# Altium schematic sheet 51开发设计.SchDoc
size A4; SheetNumber: 1; SheetTotal: 1
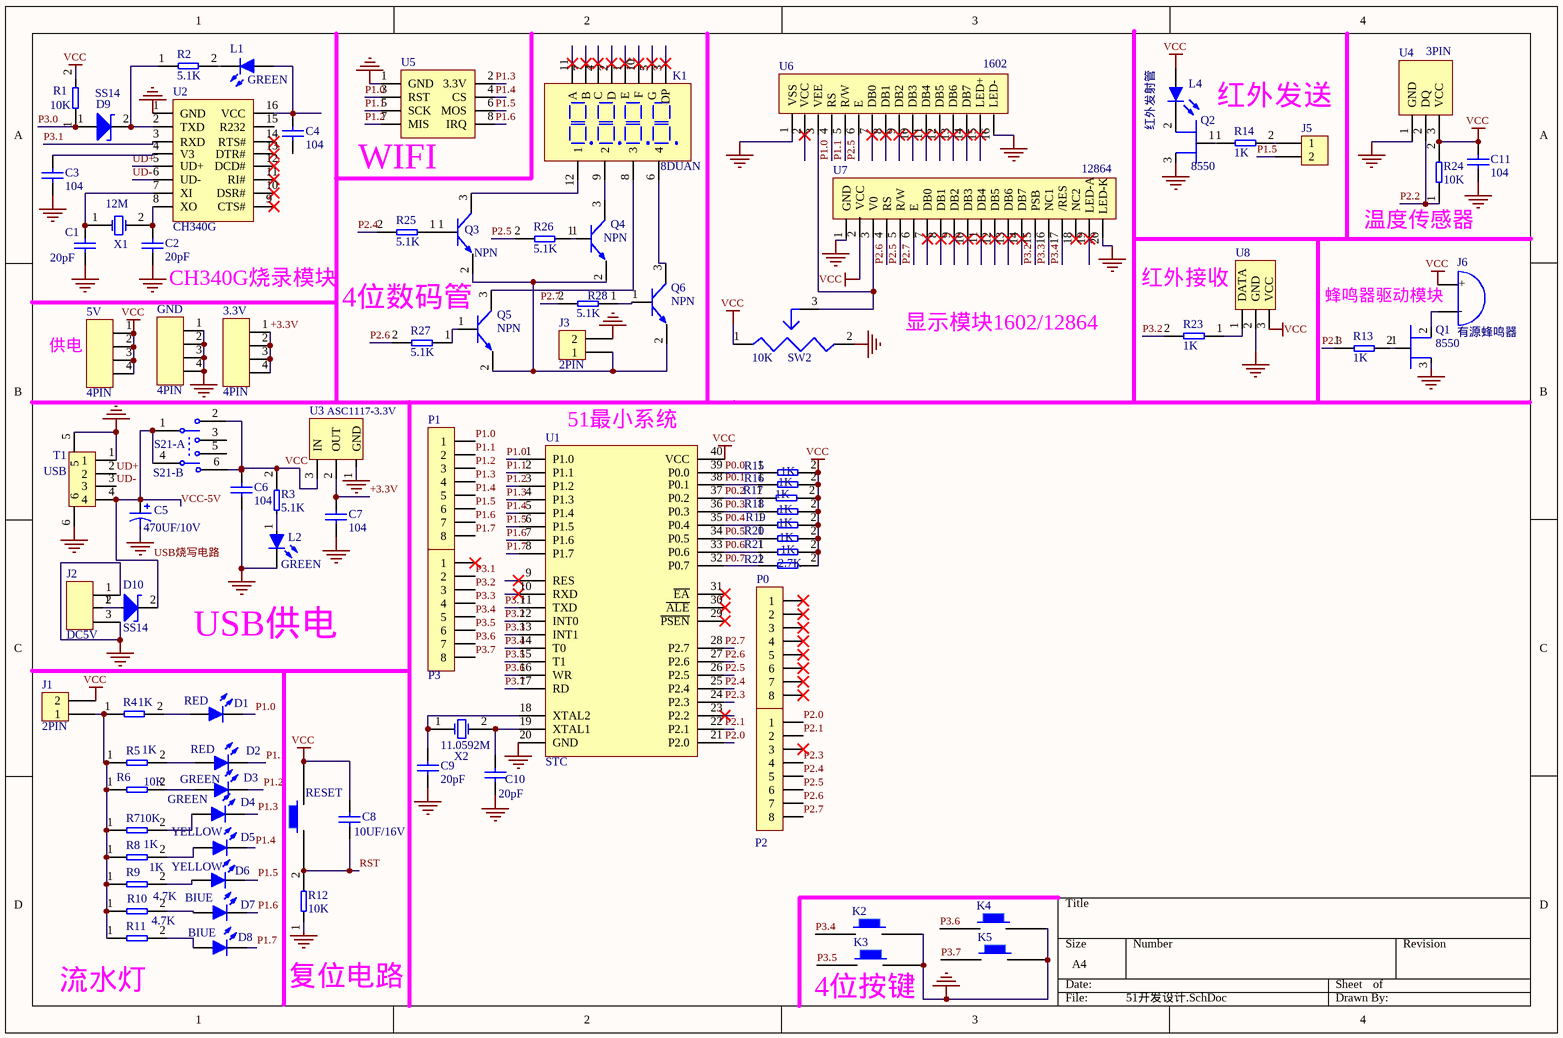
[diagram p0: 51开发设计.SchDoc]

## Parts
3.3V  4PIN  [HDR2.54-LI-4P]
5V  4PIN  [HDR2.54-LI-4P]
C1  20pF  [C0603]
C2  20pF  [C0603]
C3  104  [C0603]
C4  104  [C0603]
C5  470UF/10V  [CAP-electr-1]
C6  104  [C0603]
C7  104  [C0603]
C8  10UF/16V  [CAP-electr]
C9  20pF  [C0603]
C10  20pF  [C0603]
C11  104  [C0603]
D1  RED  [LED-R]
D2  RED  [LED-R]
D3  GREEN  [LED-G]
D4  GREEN  [LED-G]
D5  YELLOW  [LED-Y]
D6  YELLOW  [LED-Y]
D7  BIUE  [LED-B]
D8  BIUE  [LED-B]
D9  SS14  [SOD-123]
D10  SS14  [SOD-123]
GND  4PIN  [HDR2.54-LI-4P]
J1  2PIN  [HDR2.54-LI-2P]
J2  DC5V  [Power]
J3  2PIN  [HDR2.54-LI-2P]
J5  Header-2Pin  [HDR2.54-LI-2P]  (value not drawn)
J6  有源蜂鸣器  [Buzzer]
K1  8DUAN  [Digital tube]
K2  Key  [Key]  (value not drawn)
K3  Key  [Key]  (value not drawn)
K4  Key  [Key]  (value not drawn)
K5  Key  [Key]  (value not drawn)
L1  GREEN  [LED-G]
L2  GREEN  [LED-G]
L4  红外发射管  [LED infrar]
P0  Header-8Pin  [HDR2.54-LI-8P]  (value not drawn)
P1  Header-8Pin  [HDR2.54-LI-8P]  (value not drawn)
P2  Header-8Pin  [HDR2.54-LI-8P]  (value not drawn)
P3  Header-8Pin  [HDR2.54-LI-8P]  (value not drawn)
Q1  8550  [SOT-23-3]
Q2  8550  [SOT-23-3]
Q3  NPN  [SOT-23-3]
Q4  NPN  [SOT-23-3]
Q5  NPN  [SOT-23-3]
Q6  NPN  [SOT-23-3]
R1  10K  [R0603]
R2  5.1K  [R0603]
R3  5.1K  [R0603]
R4  1K  [R0603]
R5  1K  [R0603]
R6  10K  [R0603]
R7  10K  [R0603]
R8  1K  [R0603]
R9  1K  [R0603]
R10  4.7K  [R0603]
R11  4.7K  [R0603]
R12  10K  [R0603]
R13  1K  [R0603]
R14  1K  [R0603]
R15  1K  [R0603]
R16  1K  [R0603]
R17  1K  [R0603]
R18  1K  [R0603]
R19  1K  [R0603]
R20  1K  [R0603]
R21  1K  [R0603]
R22  2.7K  [R0603]
R23  1K  [R0603]
R24  10K  [R0603]
R25  5.1K  [R0603]
R26  5.1K  [R0603]
R27  5.1K  [R0603]
R28  5.1K  [R0603]
RESET  Key  [Key]  (value not drawn)
S21-A  S21-B  [SW]
SW2  10K  [Rheostat]
T1  USB  [USB-MICRO_D]
U1  STC  [STC89C5X]
U2  CH340G  [CH340G]
U3  ASC1117-3.3V  [SOT-223]
U4  3PIN  [HDR2.54-Y-LI-3P]
U5  WIFI  [WiFi Mod]  (value not drawn)
U6  1602  [HDR2.54-M-LI-16P]
U7  12864  [HDR2.54-M-LI-20P]
U8  Header-3Pin-1  [HDR2.54-Y-LI-3P]  (value not drawn)
X1  12M  [XTAL]
X2  11.0592M  [XTAL]

## Nets
GND: C1.1 C2.1 C3.1 C5.2 C6.1 C7.1 C9.1 C10.1 C11.1 GND.1 GND.2 GND.3 GND.4 J2.1 J2.3 J3.2 K2.2 K3.2 K4.2 K5.2 L2.2(K) Q1.3 Q2.3 R12.1 SW2.2 T1.1 T1.5 T1.6 U1.20(GND) U2.1(GND) U3.1(GND) U4.1(GND) U5.1(GND) U6.1(VSS) U6.16(LED-) U7.1(GND) U7.20(LED-K) U8.2(GND)
VCC: 5V.1 5V.2 5V.3 5V.4 C6.2 C8.2 C11.2 J1.2 J6.1(A) L4.1(A) R1.2 R3.2 R15.2 R16.2 R17.2 R18.2 R19.2 R20.2 R21.2 R22.2 R24.2 RESET.2 S21-A.2 S21-A.6 SW2.1 U1.40(VCC) U3.3(IN) U4.3(VCC) U7.2(VCC) U8.3(VCC)
+3.3V: 3.3V.1 3.3V.2 3.3V.3 3.3V.4 C7.2 U3.2(OUT)
P0.0: R15.1 U1.39(P0.0)
P0.1: R16.1 U1.38(P0.1)
P0.2: R17.1 U1.37(P0.2)
P0.3: R18.1 U1.36(P0.3)
P0.4: R19.1 U1.35(P0.4)
P0.5: R20.1 U1.34(P0.5)
P0.6: R21.1 U1.33(P0.6)
P0.7: R22.1 U1.32(P0.7)
P1.0: D1.2(K) P1.1 U1.1(P1.0) U5.3(RST) U6.4(RS)
P1.1: D2.2(K) P1.2 U1.2(P1.1) U5.5(SCK) U6.5(R/W)
P1.2: D3.2(K) P1.3 U1.3(P1.2) U5.7(MIS)
P1.3: D4.2(K) P1.4 U1.4(P1.3) U5.2(3.3V)
P1.4: D5.2(K) P1.5 U1.5(P1.4) U5.4(CS)
P1.5: D6.2(K) J5.2 P1.6 U1.6(P1.5) U5.6(MOS)
P1.6: D7.2(K) P1.7 U1.7(P1.6) U5.8(IRQ)
P1.7: D8.2(K) P1.8 U1.8(P1.7)
P2.0: P2.1 U1.21(P2.0)
P2.1: P2.2 U1.22(P2.1)
P2.2: R24.1 U4.2(DQ)
P2.3: P2.4 R13.1 U1.24(P2.3)
P2.4: P2.5 R25.2 U1.25(P2.4)
P2.5: P2.6 R26.2 U1.26(P2.5) U6.6(E) U7.5(R/W)
P2.6: P2.7 R27.2 U1.27(P2.6) U7.4(RS)
P2.7: P2.8 R28.2 U1.28(P2.7) U7.6(E)
P3.0: D9.1 R1.1
P3.1: P3.2 U1.11(TXD) U2.3(RXD)
P3.2: P3.3 R23.2 U1.12(INT0) U7.15(PSB)
P3.3: P3.4 U1.13(INT1) U7.16(NC1)
P3.4: K2.1 P3.5 U1.14(T0) U7.17(/RES)
P3.5: K3.1 P3.6 U1.15(T1)
P3.6: K4.1 P3.7 U1.16(WR)
P3.7: K5.1 P3.8 U1.17(RD)
RST: C8.1 R12.2 RESET.1
UD+: T1.2 U2.5(UD+)
UD-: T1.3 U2.6(UD-)
USB烧写电路: C5.1 D10.2 S21-A.1 S21-A.4 T1.4  [also labelled VCC-5V]
NetC1_2: C1.2 U2.7(XI) X1.1(OSC1)
NetC2_2: C2.2 U2.8(XO) X1.2(OSC2)
NetC3_2: C3.2 U2.4(V3)
NetC4_2: C4.2 L1.1(A) U2.16(VCC)
NetC9_2: C9.2 U1.18(XTAL2) X2.1(OSC1)
NetC10_2: C10.2 U1.19(XTAL1) X2.2(OSC2)
NetD1_1: D1.1(A) R4.2
NetD2_1: D2.1(A) R5.2
NetD3_1: D3.1(A) R6.2
NetD4_1: D4.1(A) R7.2
NetD5_1: D5.1(A) R8.2
NetD6_1: D6.1(A) R9.2
NetD7_1: D7.1(A) R10.2
NetD8_1: D8.1(A) R11.2
NetD9_2: D9.2 R2.1 U2.2(TXD)
NetD10_1: D10.1 J2.2
NetJ1_1: J1.1 R4.1 R5.1 R6.1 R7.1 R8.1 R9.1 R10.1 R11.1
NetJ3_1: J3.1 Q3.2 Q4.2 Q5.2 Q6.2
NetJ5_1: J5.1 R14.2
NetJ6_2: J6.2(B) Q1.2
NetK1_6: K1.6(4) Q6.3
NetK1_8: K1.8(3) Q5.3
NetK1_9: K1.9(2) Q4.3
NetK1_12: K1.12(1) Q3.3
NetL1_2: L1.2(K) R2.2
NetL2_1: L2.1(A) R3.1
NetL4_2: L4.2(K) Q2.2
NetQ1_1: Q1.1 R13.2
NetQ2_1: Q2.1 R14.1
NetQ3_1: Q3.1 R25.1
NetQ4_1: Q4.1 R26.1
NetQ5_1: Q5.1 R27.1
NetQ6_1: Q6.1 R28.1
NetR23_1: R23.1 U8.1(DATA)
NetSW2_3: SW2.3 U6.3(VEE) U7.3(V0)

Not connected (* = marked no-connect by the designer): C4 1; K1 1(E)* 2(D)* 3(DP)* 4(C)* 5(G)* 7(B)* 10(F)* 11(A)*; P0 1* 2* 3* 4* 5* 6* 7* 8*; P2 3*; P3 1*; S21-A 3 5; U1 9(RES)* 10(RXD)* 23(P2.2)* 29(~{PSEN})* 30(~{ALE})* 31(~{EA})*; U2 9(CTS#)* 10(DSR#)* 11(RI#)* 12(DCD#)* 13(DTR#)* 14(RTS#)* 15(R232); U6 2(VCC)* 7(DB0)* 8(DB1)* 9(DB2)* 10(DB3)* 11(DB4)* 12(DB5)* 13(DB6)* 14(DB7)* 15(LED+)*; U7 7(DB0)* 8(DB1)* 9(DB2)* 10(DB3)* 11(DB4)* 12(DB5)* 13(DB6)* 14(DB7)* 18(NC2)* 19(LED-A)*

## Notes on the sheet
- 红外发送
- (near U5) WIFI
- (near R24) 温度传感器
- (near C2) CH340G烧录模块
- (near R27) 4位数码管
- 红外接收
- 蜂鸣器驱动模块
- (near 5V) 供电
- 显示模块1602/12864
- (near U1) 51最小系统
- USB供电
- (near R11) 流水灯
- 复位电路
- (near K3) 4位按键
- (in symbol Buzzer) +; -

## Library data of the parts
3.3V 5V GND = Header-4Pin: 供电
C1-C4 C6 C7 C9-C11 = C0603: 贴片电容
C5 = CAP-EL-1: 直插电解电容
C8 = CAP-EL-2: 直插电解电容
D1 D2 = LED-R: 贴片LED
D3 D4 L1 L2 = LED-G: 贴片LED
D5 D6 = LED-Y: 贴片LED
D7 D8 = LED-B: 贴片LED
D9 D10 = Diode-2: 二极管
J1 J3 J5 = Header-2Pin: 跳线
J2 = Power: 电源接口
J6 = Buzzer
K1 = DISP: 数码管
K2-K5 RESET = Key: 轻触按键
L4 = LED infrar
P0-P3 = Header-8Pin: 排针8
Q1 Q2 = Triode-3: 三极管
Q3-Q6 = Triode-2: 三极管
R1-R28 = R0603: 贴片电阻
S21-A = SW: 开关按键
SW2 = Rheostat: 可调电位器
T1 = Micro-usb: USB写入
U1 = STC89C5X: 单片机整个
U2 = CH340G: 电源芯片
U3 = Triode-1: 三极管-烧写
U4 = Header-3Pin: 温度传感器
U5 = WIFI Module: WiFi模块
U6 = Header-16P: 排母16
U7 = Header-20P: 排母20
U8 = Header-3Pin-1: 红外接收
X1 X2 = XTAL: 直插晶振